# Altium schematic sheet Main.SchDoc: Open Reflow Oven - Top Sheet
size Letter; DrawnBy: Leonardo Márquez; Organization: Open Reflow Oven; Address1: leonardomarquez.com; Address2: github.com/marqueztronics; DocumentNumber: 001; Revision: A02; SheetNumber: 1; SheetTotal: 5
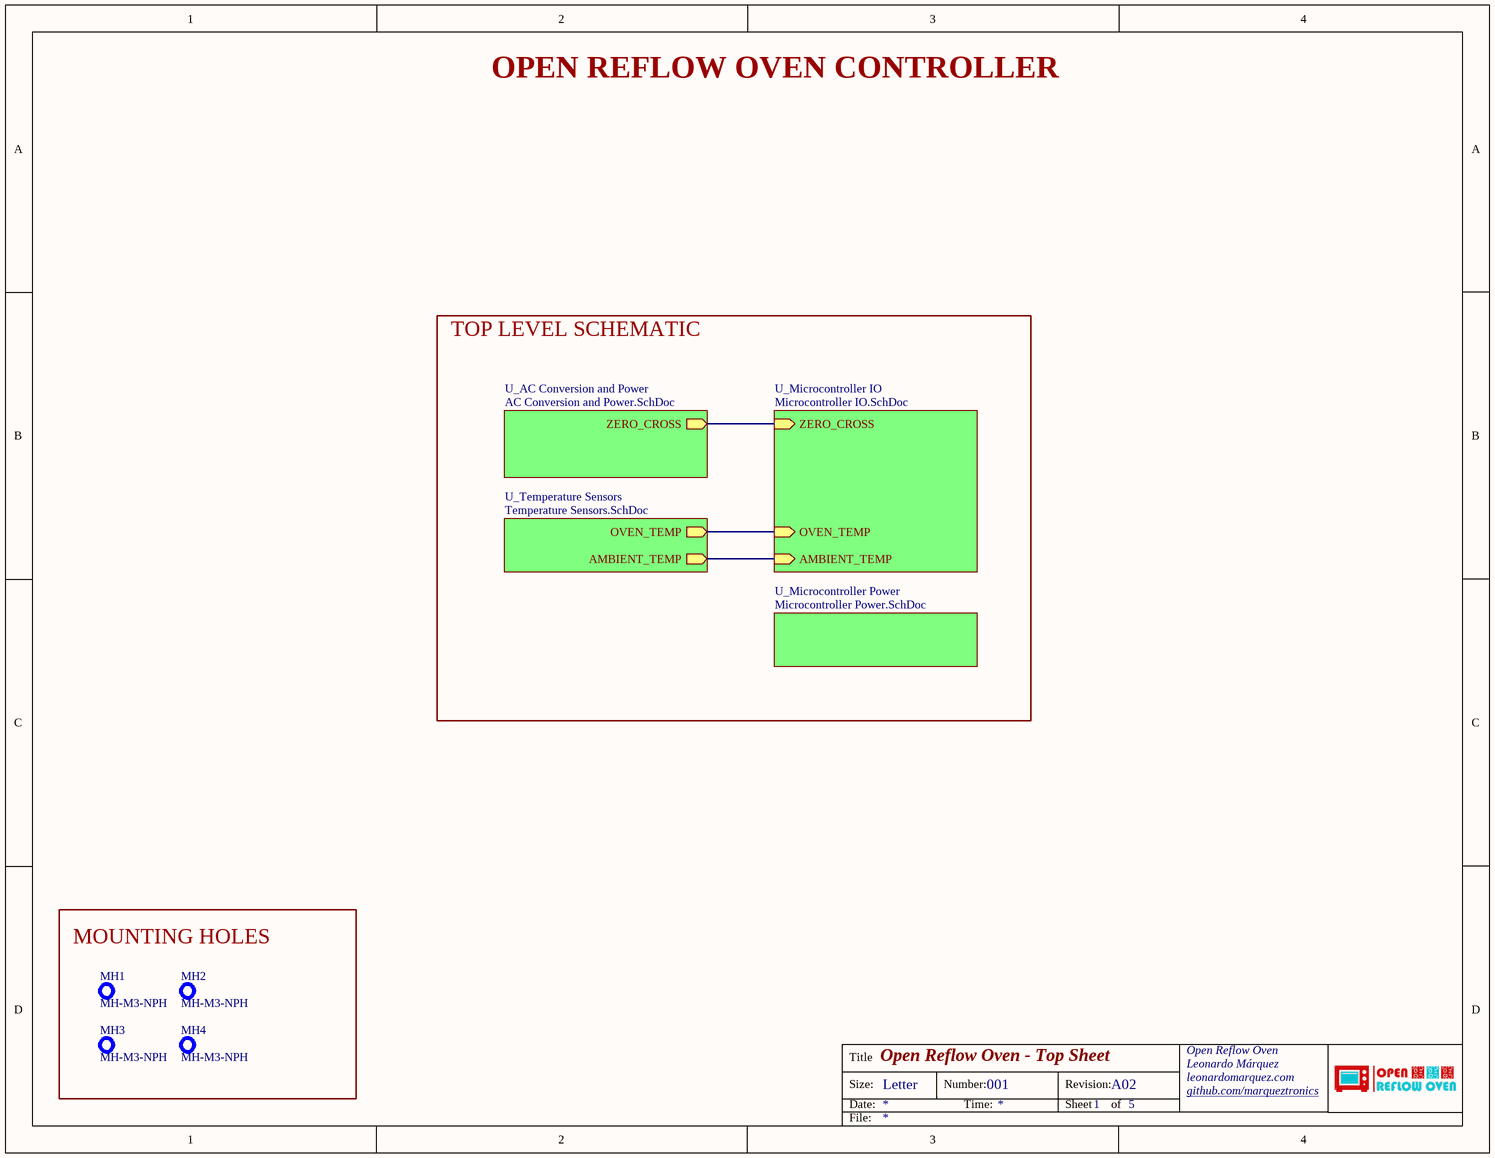
[diagram p0: Main.SchDoc]

## Parts
MH1  MH-M3-NPH  [MH-M3-NPH]  (no BOM)
MH2  MH-M3-NPH  [MH-M3-NPH]  (no BOM)
MH3  MH-M3-NPH  [MH-M3-NPH]  (no BOM)
MH4  MH-M3-NPH  [MH-M3-NPH]  (no BOM)

## Blocks framed on the sheet
MOUNTING HOLES: MH1-MH4

## Sub-sheets
U_AC Conversion and Power = AC Conversion and Power.SchDoc: ZERO_CROSS (out)
U_Microcontroller IO = Microcontroller IO.SchDoc: ZERO_CROSS (in), OVEN_TEMP (in), AMBIENT_TEMP (in)
U_Microcontroller Power = Microcontroller Power.SchDoc: no entries
U_Temperature Sensors = Temperature Sensors.SchDoc: OVEN_TEMP (out), AMBIENT_TEMP (out)

## Nets
(unnamed): sheet U_AC Conversion and Power/ZERO_CROSS, sheet U_Microcontroller IO/ZERO_CROSS
(unnamed): sheet U_Microcontroller IO/OVEN_TEMP, sheet U_Temperature Sensors/OVEN_TEMP
(unnamed): sheet U_Microcontroller IO/AMBIENT_TEMP, sheet U_Temperature Sensors/AMBIENT_TEMP

## Notes on the sheet
- OPEN REFLOW OVEN CONTROLLER
- TOP LEVEL SCHEMATIC
- Title
- Size:
- Date:
- Letter
- Number:
- Time:
- Revision:
- Sheet
- of
- File:

## Library data of the parts
MH1-MH4 = MH-M3-NPH: Mounting Hole M3 Non Plated Hole; Manufacturer: *; Manufacturer Part Number: *; Price Unit: *; Price 1K: *; Supplier 1: *; Supplier Part Number 1: *